# Altium schematic sheet THS788_1.SchDoc: FIT_PM12 board
size 420 x 297 mm; CheckedBy: G.Kasprowicz; Author: INR Moscow; CompanyName: WUT ISE; DrawnBy: M.Podgórski; Organization: WUT ISE; Address1: PW ISE; Address2: Nowowiejska 15/19 00-665 Warsaw; Address3: gkasprow@gmail.com; DocumentNumber: 22; Revision: 2; SheetNumber: 28; SheetTotal: 34; ModifiedBy: -; CheckedDate: -; Title2: TDC1; DivGrp: WUT ISE; Designer: INR RAS; ModifiedDate: -; ProjectName: Sensor Box
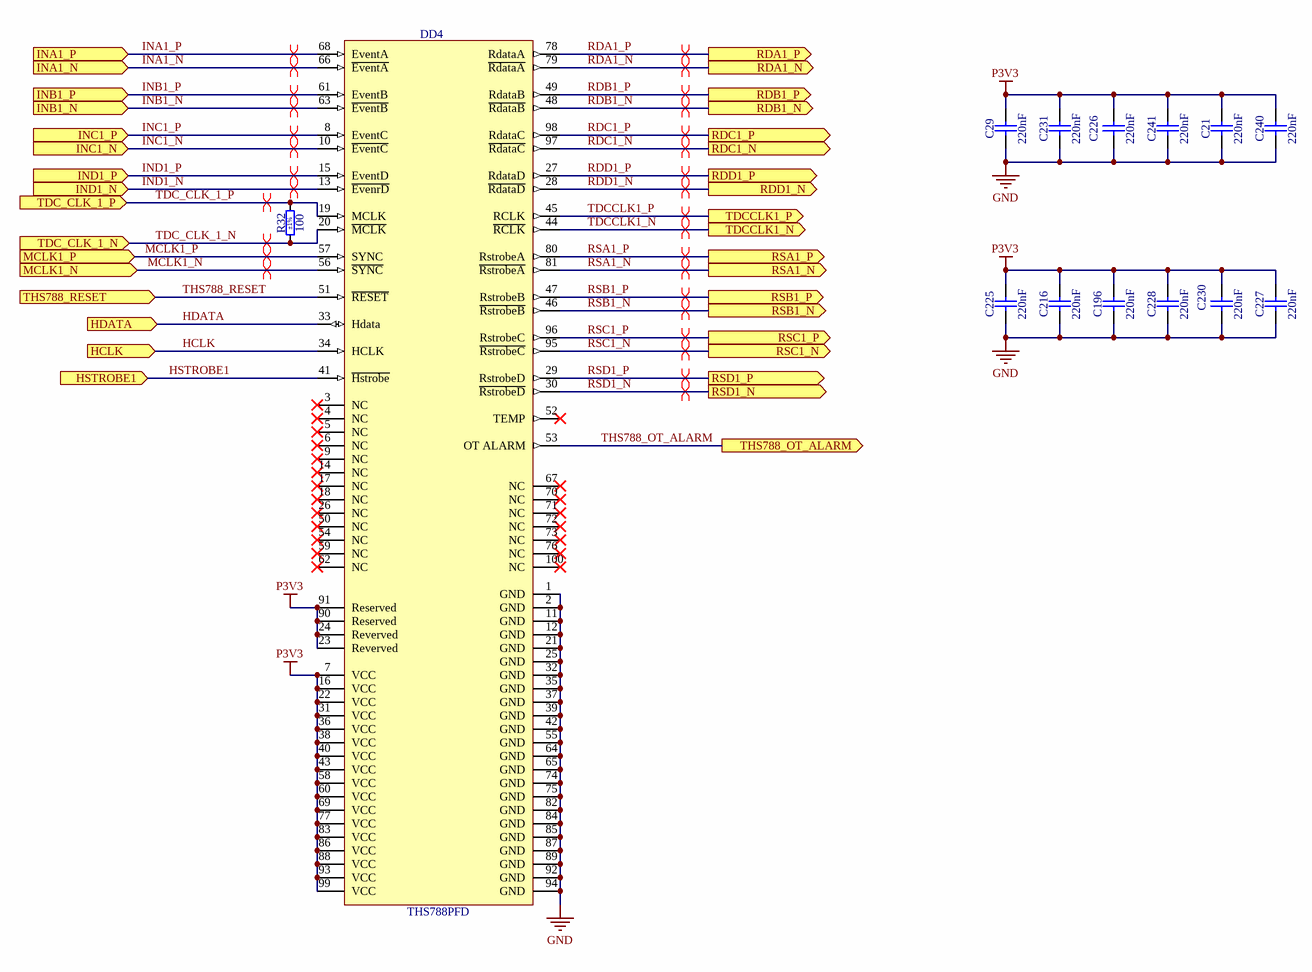
[diagram p0: THS788_1.SchDoc]

## Parts
C21  220nF  [CAPC2012X135N]
C29  220nF  [CAPC2012X135N]
C196  220nF  [CAPC2012X135N]
C216  220nF  [CAPC2012X135N]
C225  220nF  [CAPC2012X135N]
C226  220nF  [CAPC2012X135N]
C227  220nF  [CAPC2012X135N]
C228  220nF  [CAPC2012X135N]
C230  220nF  [CAPC2012X135N]
C231  220nF  [CAPC2012X135N]
C240  220nF  [CAPC2012X135N]
C241  220nF  [CAPC2012X135N]
DD4  THS788PFD  [TEXAS_PFD (S-PQFP-G100)]
R32  100  Tolerance: ±1%  [RESC1608X55N]

## Ports
HCLK (in), HDATA (in), HSTROBE1 (in), INA1_N (in), INA1_P (in), INB1_N (in), INB1_P (in), INC1_N (in), INC1_P (in), IND1_N (in), IND1_P (in), MCLK1_N (in), MCLK1_P (in), RDA1_N (out), RDA1_P (out), RDB1_N (out), RDB1_P (out), RDC1_N (out), RDC1_P (out), RDD1_N (out), RDD1_P (out), RSA1_N (out), RSA1_P (out), RSB1_N (out), RSB1_P (out), RSC1_N (out), RSC1_P (out), RSD1_N (out), RSD1_P (out), TDC_CLK_1_N (in), TDC_CLK_1_P (in), TDCCLK1_N (out), TDCCLK1_P (out), THS788_OT_ALARM (out), THS788_RESET (in)

## Nets
GND: C21.1 C29.1 C196.1 C216.1 C225.1 C226.1 C227.1 C228.1 C230.1 C231.1 C240.1 C241.1 DD4.1(GND) DD4.2(GND) DD4.11(GND) DD4.12(GND) DD4.21(GND) DD4.25(GND) DD4.32(GND) DD4.35(GND) DD4.37(GND) DD4.39(GND) DD4.42(GND) DD4.55(GND) DD4.64(GND) DD4.65(GND) DD4.74(GND) DD4.75(GND) DD4.82(GND) DD4.84(GND) DD4.85(GND) DD4.87(GND) DD4.89(GND) DD4.92(GND) DD4.94(GND)
P3V3: C21.2 C29.2 C196.2 C216.2 C225.2 C226.2 C227.2 C228.2 C230.2 C231.2 C240.2 C241.2 DD4.7(VCC) DD4.16(VCC) DD4.22(VCC) DD4.23(Reverved) DD4.24(Reverved) DD4.31(VCC) DD4.36(VCC) DD4.38(VCC) DD4.40(VCC) DD4.43(VCC) DD4.58(VCC) DD4.60(VCC) DD4.69(VCC) DD4.77(VCC) DD4.83(VCC) DD4.86(VCC) DD4.88(VCC) DD4.90(Reserved) DD4.91(Reserved) DD4.93(VCC) DD4.99(VCC)
HCLK: DD4.34(HCLK) ; port HCLK
HDATA: DD4.33(Hdata) ; port HDATA
HSTROBE1: DD4.41(~{Hstrobe}) ; port HSTROBE1
INA1_N: DD4.66(~{EventA}) ; port INA1_N
INA1_P: DD4.68(EventA) ; port INA1_P
INB1_N: DD4.63(~{EventB}) ; port INB1_N
INB1_P: DD4.61(EventB) ; port INB1_P
INC1_N: DD4.10(~{EventC}) ; port INC1_N
INC1_P: DD4.8(EventC) ; port INC1_P
IND1_N: DD4.13(~{EvenrD}) ; port IND1_N
IND1_P: DD4.15(EventD) ; port IND1_P
MCLK1_N: DD4.56(~{SYNC}) ; port MCLK1_N
MCLK1_P: DD4.57(SYNC) ; port MCLK1_P
RDA1_N: DD4.79(~{RdataA}) ; port RDA1_N
RDA1_P: DD4.78(RdataA) ; port RDA1_P
RDB1_N: DD4.48(~{RdataB}) ; port RDB1_N
RDB1_P: DD4.49(RdataB) ; port RDB1_P
RDC1_N: DD4.97(~{RdataC}) ; port RDC1_N
RDC1_P: DD4.98(RdataC) ; port RDC1_P
RDD1_N: DD4.28(~{RdataD}) ; port RDD1_N
RDD1_P: DD4.27(RdataD) ; port RDD1_P
RSA1_N: DD4.81(~{RstrobeA}) ; port RSA1_N
RSA1_P: DD4.80(RstrobeA) ; port RSA1_P
RSB1_N: DD4.46(~{RstrobeB}) ; port RSB1_N
RSB1_P: DD4.47(RstrobeB) ; port RSB1_P
RSC1_N: DD4.95(~{RstrobeC}) ; port RSC1_N
RSC1_P: DD4.96(RstrobeC) ; port RSC1_P
RSD1_N: DD4.30(~{RstrobeD}) ; port RSD1_N
RSD1_P: DD4.29(RstrobeD) ; port RSD1_P
TDC_CLK_1_N: DD4.20(~{MCLK}) R32.1 ; port TDC_CLK_1_N
TDC_CLK_1_P: DD4.19(MCLK) R32.2 ; port TDC_CLK_1_P
TDCCLK1_N: DD4.44(~{RCLK}) ; port TDCCLK1_N
TDCCLK1_P: DD4.45(RCLK) ; port TDCCLK1_P
THS788_OT_ALARM: DD4.53(OT_ALARM) ; port THS788_OT_ALARM
THS788_RESET: DD4.51(~{RESET}) ; port THS788_RESET

Not connected (* = marked no-connect by the designer): DD4 3(NC)* 4(NC)* 5(NC)* 6(NC)* 9(NC)* 14(NC)* 17(NC)* 18(NC)* 26(NC)* 50(NC)* 52(TEMP)* 54(NC)* 59(NC)* 62(NC)* 67(NC)* 70(NC)* 71(NC)* 72(NC)* 73(NC)* 76(NC)* 100(NC)*

## Layout directives
differential pair: INA1_N, INA1_P, INB1_N, INB1_P, INC1_N, INC1_P, IND1_N, IND1_P, MCLK1_N, MCLK1_P, RDA1_N, RDA1_P, RDB1_N, RDB1_P, RDC1_N, RDC1_P, RDD1_N, RDD1_P, RSA1_N, RSA1_P, RSB1_N, RSB1_P, RSC1_N, RSC1_P, RSD1_N, RSD1_P, TDC_CLK_1_N, TDC_CLK_1_P, TDCCLK1_N, TDCCLK1_P

## Notes on the sheet
- Project/Equipment
- Document
- Designer
- Drawn by
- Check.by
- Copyright WUT ISE 2024.
  This documentation describes Open Hardware and is licensed under the CERN OHL v.2. You may redistribute and modify this documentation under the terms of the CERN OHL v.2. (http://ohwr.org/CERNOHL). This documentation is distributed WITHOUT ANY EXPRESS OR IMPLIED WARRANTY, INCLUDING OF MERCHANTABILITY, SATISFACTORY QUALITY AND FITNESS FOR A PARTICULAR PURPOSE. Please see the CERN OHL v.2 for applicable conditions.
- Contact
- File
- Last Mod.
- Print Date
- Sheet
- Size
- A3
- of
- Rev

## Library data of the parts
C21 C29 C196 C216 C225-C228 C230 C231 C240 C241 = CC0805_220NF_50V_10%_X7R: Non-polarised capacitor; Part Description: SMD Multilayer Chip Ceramic Capacitor; Manufacturer: GENERIC; Manufacturer1 Part Number: GRM21BR71H224KA01L; Voltage: 50V; TC: X7R; Tolerance: ±10%; Part Number: CC0805_220NF_50V_10%_X7R; Component Kind: Standard; Component Type: Standard; Pin Count: 2; Value: 220nF; Status: Preferred; Manufacturer Part Number: CC0805_220NF_50V_10%_X7R; Case: 0805; Mounted: Yes; Socket: No; SMD: Yes; Sense: No; Manufacturer1 Example: MURATA; Manufacturer1 ComponentHeight: 1.35mm; HelpURL: \\cern.ch\dfs\Applications\Altium\Datasheets\CC0805_X7R_MURATA.pdf; Author: CERN DEM JLC; CreateDate: 03.12.2007; LatestRevisionDate: 03.12.2007
DD4 = THS788PFD: Quad-Channel Time Measurement Unit (TMU); Manufacturer: TEXAS INSTRUMENTS; PressFit: No; Bonding: No; Part Number: THS788PFD; Component Kind: Standard; Component Type: Standard; Device: THS788PFD; Footprint: TEXAS_1PFD (S-PQFP-G100); PackageDescription: QFP, 0.50mm Pitch, Square; 100 Pin, 14.0mm L X 14.0mm W X 1.20mm H body (w/Thermal Tab 6.0 X 6.0mm), IPC Medium Density; Status: Not Recommended; Part Description: Quad-Channel Time Measurement Unit (TMU); Manufacturer Part Number: THS788PFD; Pin Count: 101; Case: QFP100; Mounted: Yes; Socket: No; SMD: Yes; Sense: No; ComponentHeight: 1.2mm; Author: CERN DEM HF; HelpURL: \\cern.ch\dfs\Applications\Altium\Datasheets\THS788.pdf; CreateDate: 10.06.2024; LatestRevisionDate: 10.06.2024
R32 = R0603_100R_1%_0.1W_100PPM: Resistor - 1%; Part Description: General Purpose Thick Film Chip Resistor; Manufacturer: GENERIC; Manufacturer1 Part Number: NRC06F4700TRF; Power: 0.1W; TC: ±100ppm/°C; PressFit: No; Part Number: R0603_100R_1%_0.1W_100PPM; Component Kind: Standard; Component Type: Standard; Pin Count: 2; Value: 100; Status: Preferred; Manufacturer Part Number: R0603_100R_1%_0.1W_100PPM; Case: 0603; Mounted: Yes; Sense: No; Socket: No; SMD: Yes; Manufacturer1 Example: NIC COMPONENT; Manufacturer1 ComponentHeight: 0.55mm; HelpURL: \\cern.ch\dfs\Applications\Altium\Datasheets\R0603_1NIC_1NRC.pdf; Author: CERN DEM JLC; CreateDate: 03.12.2007; LatestRevisionDate: 13.03.2008